# EAGLE design untitled (EAGLE 7.2.0)
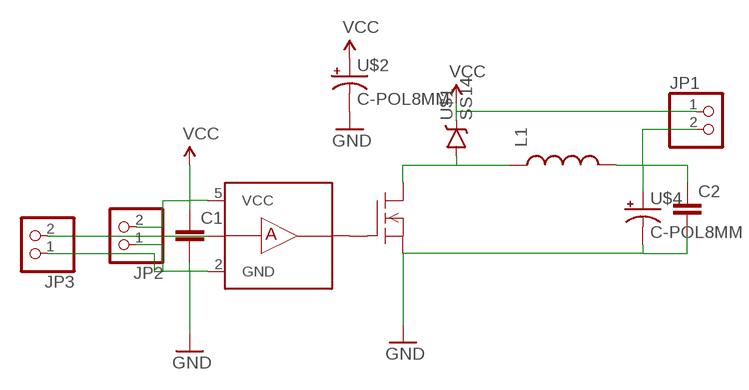
[diagram p0: schematic, sheet 1]

## Parts
C1  CC0805  [C0805]
C2  CC0805  [C0805]
JP1  PINHD-1X02_2.54  [1X02]
JP2  PINHD-1X02_2.54  [1X02]
JP3  PINHD-1X02_2.54  [1X02]
L1  INDUCTORDR1030  [DR1030]
U$1  SS14  [SMA-DIODE]
U$2  C-POL8MM  [PCAP8]
U$3  DFET  [DIRECT-FET]
U$4  C-POL8MM  [PCAP8]
U$5  IRS44273  [SOT23-5L]

## Nets
GND: C1.2 C2.2 JP2.1 JP3.1 U$2.P$2(-) U$3.S U$3.S1(S) U$4.P$2(-) U$5.2(GND)
N$1: JP3.2 U$5.1(INA)
N$3: L1.1 U$1.A U$3.D U$3.D1(D)
N$5: U$3.GATE(G) U$5.3(OUTA) U$5.4(OUTA)
N$8: C2.1 JP1.2 L1.2 U$4.P$1(+)
VCC: C1.1 JP1.1 JP2.2 U$1.C U$2.P$1(+) U$5.5(VCC)

## Library data of the parts
C1 C2 = CasaLibrary:C: Capacitor
JP1-JP3 = pinhead-2:PINHD-1X02: PIN HEADER
L1 = SparkFun-Passives:INDUCTOR: Inductors Basic Inductor/Choke - 0603 and 1206. Footprints are not proven and vary greatly between part numbers. INDUCTOR POWER 3.3UH 4.0A SMD 0.197" L x 0.197" W x 0.177" H (5.00mm x 5.00mm x 4.50mm)
U$1 = CasaLibrary:SS14
U$2 U$4 = CasaLibrary:C-POL
U$3 = CasaLibrary:DFET
U$5 = CasaLibrary:IRS44273

## Board
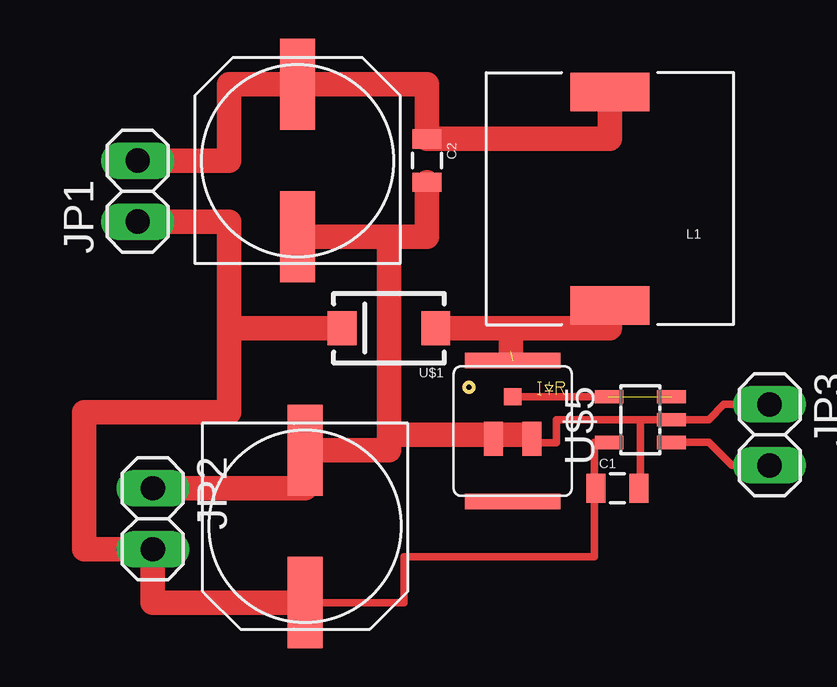
[diagram p1: board, top side]

Size 4.2 x 0.56 mm. Coordinates in mm from the lower left corner, seen from the top.
Copper layers [2:1+((2*3)+(4*16))]: Top 0.035mm / dielectric 1.5mm / Route2 0.035mm / dielectric 0.15mm / Route3 0.035mm / dielectric 0.2mm / Route4 0.035mm / dielectric 0.15mm / Bottom 0.035mm
Design rules "default *": minimum track width 0.2mm, minimum drill 0.2mm, track to track 0.2mm, track to pad 0.2mm, pad to pad 0.2mm, via to via 0.2mm, smd to smd 0.2mm, copper to edge 0.2mm, drill to drill 0.2mm, minimum pad ring 10mil, minimum via ring 8mil, stop-mask expansion 0mil, vias tented up to drill 0mil, thermal gap 10mil

### Footprints (pad centres in the part's own frame; a part is rotated, then mirrored left to right if it is on the bottom)
C0805 = smd 0.8 x 1.2: 1 -0.9,0; 2 0.9,0
1X02 = drill 1.016 long: 1 -1.27,0; 2 1.27,0
DR1030 = smd 3.3 x 1.6: 1 0,4.45; 2 0,-4.45
SMA-DIODE = smd 1.2 x 1.4: A -1.95,0; C 1.95,0
PCAP8 = smd 3.8 x 1.46: P$1 -3.175,0; P$2 3.175,0
DIRECT-FET = smd 3.969 x 0.635: D 0.079,3.096; D1 0.079,-2.778 | smd 0.714 x 0.714: GATE 0.079,1.587 | smd 0.794 x 1.429: S -0.714,-0.159; S1 0.873,-0.159
SOT23-5L = smd 0.55 x 1.2: 1 -0.95,-1.3; 2 0,-1.3; 3 0.95,-1.3; 4 0.95,1.3; 5 -0.95,1.3

### Placement (x,y rotation side)
C1  6.42,-3.89 0 top  (outside the outline)
C2  -1.52,9.76 270 top  (outside the outline)
JP1  -13.59,8.49 90 top  (outside the outline)
JP2  -12.95,-5.16 270 top  (outside the outline)
JP3  12.77,-1.67 270 top  (outside the outline)
L1  6.1,8.18 180 top  (outside the outline)
U$1  -3.11,2.78 180 top
U$2  -6.6,-5.48 90 top  (outside the outline)
U$3  1.97,-1.67 0 top
U$4  -6.92,9.76 270 top  (outside the outline)
U$5  7.37,-1.03 90 top

### Tracks (layer width: path | path; a pad name or v marks a point on that pad's centre or on a via)
GND
  Top 0.305: C1.2 7.37,-3.89 7.37,-1.03 U$5.2 | U$5.2 3.88,-1.03 3.88,-1.98 2.84,-1.98 U$3.S1 U$3.S | JP3.1 10.86,-0.4 10.23,-1.03 U$5.2
  Top 1.016: -3.11,-1.67 1.26,-1.67 U$3.S 1.41,-1.67 2.61,-1.67 | U$4.P$2 -3.11,6.59 | C2.2 -1.52,6.59 -3.11,6.59 | -3.11,6.59 -3.11,-1.67 | JP2.1 -6.6,-3.89 U$2.P$2 -3.11,-2.3 -3.11,-1.67
N$1
  Top 0.305: U$5.1 10.22,-1.98 11.18,-2.94 JP3.2
N$3  (1 unrouted)
  Top 1.016: U$1.A 1.97,2.78 | L1.1 6.1,2.78 1.97,2.78 | 1.97,2.78 1.97,1.83
N$5  (1 unrouted)
  Top 0.305: U$5.4 U$3.GATE
N$8
  Top 1.016: L1.2 6.09,10.66 C2.1 -1.52,12.94 U$4.P$1 -9.78,12.94 -9.78,9.76 JP1.2
TST  (via drill 0.6)
  other vias: 24.51,5.95 24.51,3.41
  pour Top: 19.43,7.54 37.53,7.54 37.53,-4.84 19.43,-4.84
VCC
  Top 0.305: 5.46,-3.89 5.46,-1.98 | 5.46,-1.98 U$5.5 5.46,-1.98 | 5.46,-3.89 C1.1 | 5.46,-3.89 5.46,-6.75 -2.47,-6.75 -2.47,-8.65 U$2.P$1
  Top 1.016: JP1.1 -9.78,7.22 -9.78,2.78 | -9.78,2.78 -9.78,-0.71 -15.81,-0.71 -15.81,-6.43 JP2.2 -12.95,-8.65 U$2.P$1 | U$1.C -9.78,2.78
(copper drawn outside any net)
  shapes: Route2 area x1